# EAGLE design working (EAGLE 6.6.0)
COMPANY: ADAFRUIT INDUSTRIES; DRAWN: KTOWN; REV: A
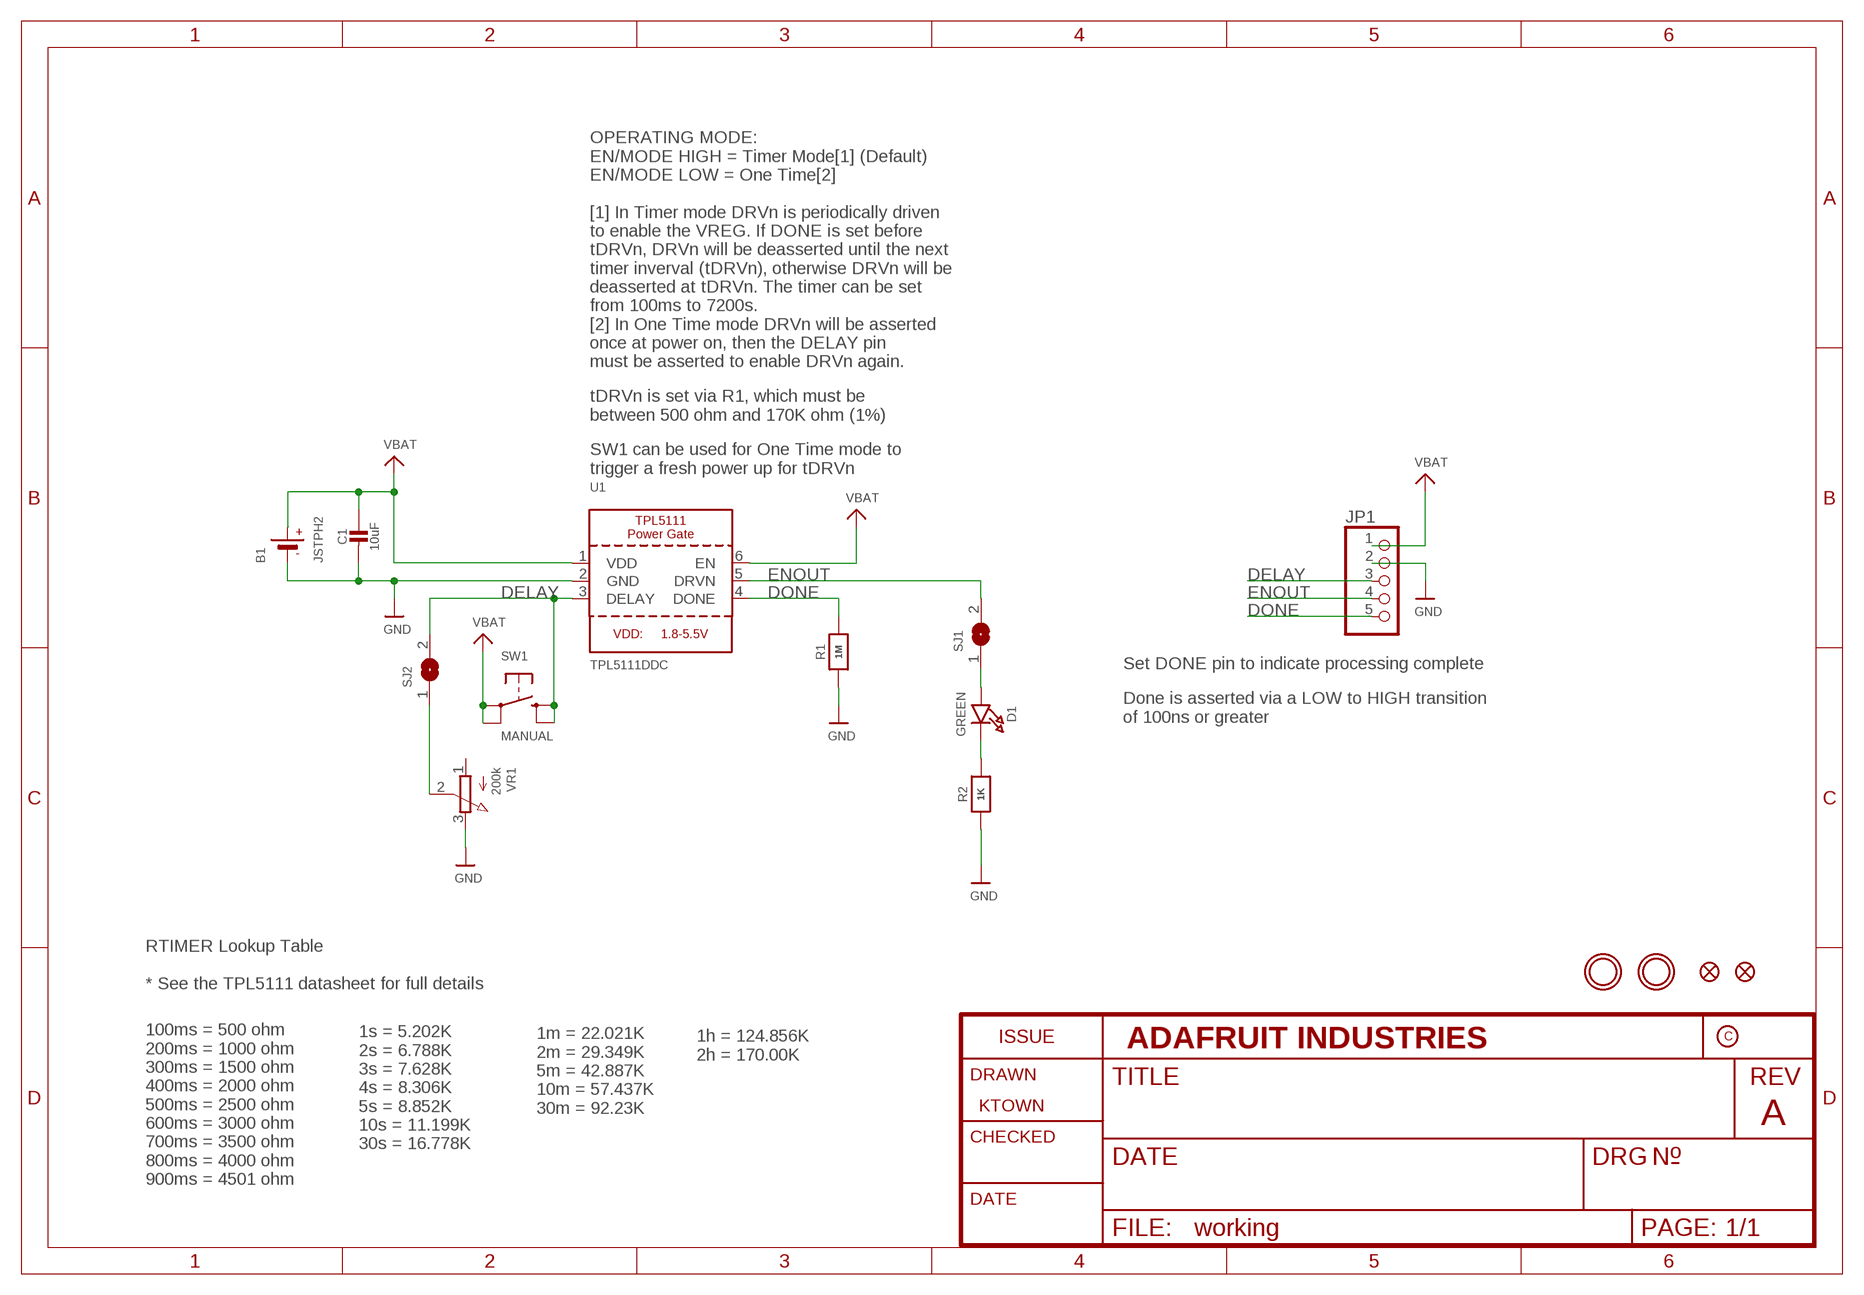
[diagram p0: schematic, sheet 1]

## Parts
B1  JSTPH2  BATTERY  [JSTPH2]
C1  10uF  CAP_CERAMIC0805-NOOUTLINE  [0805-NO]
D1  GREEN  LED0805_NOOUTLINE  [CHIPLED_0805_NOOUTLINE]
FID2  FIDUCIAL_1MM  [FIDUCIAL_1MM]
FID3  FIDUCIAL_1MM  [FIDUCIAL_1MM]
JP1  HEADER-1X576MIL  [1X05_ROUND_76]
R1  1M  RESISTOR0805_NOOUTLINE  [0805-NO]
R2  1K  RESISTOR0805_NOOUTLINE  [0805-NO]
SJ1  SOLDERJUMPERCLOSED  [SOLDERJUMPER_CLOSEDWIRE]
SJ2  SOLDERJUMPERCLOSED  [SOLDERJUMPER_CLOSEDWIRE]
SW1  MANUAL  SWITCH_TACT_SMT_EVQQ2_SMALL  [EVQ-Q2_SMALLER]
U1  TPL5111DDC  TPL5111  [SOT23-6]
U$8  MOUNTINGHOLE2.5  [MOUNTINGHOLE_2.5_PLATED]
U$9  MOUNTINGHOLE2.5  [MOUNTINGHOLE_2.5_PLATED]
VR1  200k  TRIMPOTTC33X-2  [TRIMPOT_BOURNS_TC33X-2]

## Nets
DELAY: JP1.3 SJ2.2 SW1.B'(S1) SW1.B(S) U1.3(DELAY)
DONE: JP1.5 R1.2 U1.4(DONE)
ENOUT: JP1.4 SJ1.2 U1.5(DRVN)
GND: B1.1(-) C1.2 JP1.2 R1.1 R2.1 U1.2(GND) VR1.3(E)
N$1: SJ2.1 VR1.2(S)
N$2: D1.A SJ1.1
N$3: D1.C R2.2
VDD: B1.2(+) C1.1 JP1.1 SW1.A'(P1) SW1.A(P) U1.1(VDD) U1.6(EN) ; supply symbol labelled VBAT
Unconnected: VR1.1(A)

## Notes on the sheet
- OPERATING MODE:
  EN/MODE HIGH = Timer Mode[1] (Default)
  EN/MODE LOW = One Time[2]
  
  [1] In Timer mode DRVn is periodically driven
  to enable the VREG. If DONE is set before
  tDRVn, DRVn will be deasserted until the next
  timer inverval (tDRVn), otherwise DRVn will be
  deasserted at tDRVn. The timer can be set
  from 100ms to 7200s.
  [2] In One Time mode DRVn will be asserted
  once at power on, then the DELAY pin
  must be asserted to enable DRVn again.
- tDRVn is set via R1, which must be
  between 500 ohm and 170K ohm (1%)
- SW1 can be used for One Time mode to
  trigger a fresh power up for tDRVn
- Set DONE pin to indicate processing complete
- Done is asserted via a LOW to HIGH transition
  of 100ns or greater
- RTIMER Lookup Table
  
  * See the TPL5111 datasheet for full details
- 1h = 124.856K
  2h = 170.00K
- 1m = 22.021K
  2m = 29.349K
  5m = 42.887K
  10m = 57.437K
  30m = 92.23K
- 1s = 5.202K
  2s = 6.788K
  3s = 7.628K
  4s = 8.306K
  5s = 8.852K
  10s = 11.199K
  30s = 16.778K
- 100ms = 500 ohm
  200ms = 1000 ohm
  300ms = 1500 ohm
  400ms = 2000 ohm
  500ms = 2500 ohm
  600ms = 3000 ohm
  700ms = 3500 ohm
  800ms = 4000 ohm
  900ms = 4501 ohm

## Library data of the parts
B1 = microbuilder:BATTERY: CR1220 SMT - Digikey: 3001K-ND CD2032 BAT-HLD-001 - Digikey: BAT-HLD-001-ND
C1 = microbuilder:CAP_CERAMIC: Ceramic Capacitors For new designs, use the packages preceded by an '_' character since they are more reliable: The following footprints should be used on most boards: _0402 - Standard footprint for regular board layouts _0603 - Standard footprint for regular board layouts _0805 - Standard footprint for regular board layouts _1206 - Standard footprint for regular board layouts For extremely tight-pitch boards where space is at a premium, the following 'micro-pitch' footprints can be used (smaller pads, no silkscreen outline, etc.): _0402MP - Micro-pitch footprint for very dense/compact boards _0603MP - Micro-pitch footprint for very dense/compact boards _0805MP - Micro-pitch footprint for very dense/compact boards _1206MP - Micro-pitch footprint for very dense/compact boards
D1 = microbuilder:LED: LED 0603 - 0603 Surface Mount Package 2mA: Green LED - Low Power (3.9mcd, 2ma, 1.7Vf) - Digikey: 475-2709-2-ND Orange LED - Low Power (9.8mcd, 2ma, 1.8Vf) - Digikey: 475-1194-2-ND Red LED - Low Power (5mcd, 2ma, 1.8Vf) - Digikey: 475-1195-2-ND Yellow LED - Low Power (7mcd, 2ma, 1.8Vf) - Digikey: 475-1196-2-ND 5mA: Blue LED - Low Power (17mcd, 5ma, 2.9Vf) - Digikey: LNJ937W8CRACT-ND 0805 - 0805 Surface Mount Package 2mA: Red LED (8.8mcd, 2mA, 1.8Vf, Clear) - Low Power [Digikey: 475-2510-1-ND] Green LED (5mcd, 2mA, 1.8Vf, Clear) - Low Power [Digikey: 475-2730-1-ND] Yellow LED (11.3mcd, 2mA, 1.8Vf, Clear) - Low Power [Digikey: 475-2555-1-ND] 20mA: Red LED (104mcd, 20mA, Diffused) - LS R976 [Digikey: 475-1278-6-ND] Red LED (12mcd, 20mA, 2.0Vf, Clear) - APT2012EC [Digikey: 754-1128-1-ND] Green LED (15mcd, 20mA, 2.2Vf, Clear) - APT2012GC [Digikey: 754-1131-1-ND] Orange LED (160mcd, 20mA, 2.1Vf, Clear) - APT2012SECK [Digikey: 754-1130-1-ND] 1206 - 1206 Surface Mount Package Green LED (26mcd, 20mA, Diffused) - LG N971 [Digikey: 475-1407-6-ND] Red LED (15mcd, 20mA, Diffused) - LH N974 [Digikey: 475-1416-6-ND] Cree - Cree High-Power Surface Mount LEDs XPEBWT-L1-0000-00D50 - White 111lm 350mA 2.9Vf 6200K 110° XTEAWT-00-0000-00000LEE3 - White 114lm 350mA 2.85Vf 5000K 115° Everlight - Everlight 45-21 Series Surface Mount LEDs 45-21/QK2C-B2832AC2CB2/2T - Warm White 2000mcd 20mA 3.25Vf 3050K 120° 45-21/LK2C-B38452C4CB2/2T - Nuetral White 2000mcd 20mA 3.25Vf 4150K 120° 45-21/LK2C-B50634C6CB2/2T - Cold White 2200mcd 20mA 3.25Vf 5650K 120° PLCC2 Reverse Mount LS T77K-J1L2-1-0-2-R18-Z - Red 11.25mcd 2mA 1.8Vf 630nm 120° LO T77K-L1M2-24-Z - Orange 19.6mcd 2mA 1.8Vf 606nm 120° LY T77K-K2M1-26-Z - Yellow 15.7mcd 2mA 1.8Vf 587nm 120°
FID2 FID3 = microbuilder:FIDUCIAL: Fiducial Alignment Points Various fiducial points for machine vision alignment.; BOM: EXCLUDE
JP1 = microbuilder:HEADER-1X5: PIN HEADER
R1 R2 = microbuilder:RESISTOR: Resistors For new designs, use the packages preceded by an '_' character since they are more reliable: The following footprints should be used on most boards: _0402 - Standard footprint for regular board layouts _0603 - Standard footprint for regular board layouts _0805 - Standard footprint for regular board layouts _1206 - Standard footprint for regular board layouts For extremely tight-pitch boards where space is at a premium, the following 'micro-pitch' footprints can be used (smaller pads, no silkscreen outline, etc.): _0402MP - Micro-pitch footprint for very dense/compact boards _0603MP - Micro-pitch footprint for very dense/compact boards _0805MP - Micro-pitch footprint for very dense/compact boards _1206MP - Micro-pitch footprint for very dense/compact boards
SJ1 SJ2 = microbuilder:SOLDERJUMPER: SMD Solder JUMPER Solder the two pads together to create a connection, or remove the solder to break it. REFLOW - Use this footprint for solder paste and reflow ovens. WAVE - Use this footprint for hand-soldering (larger pads). CLOSED - Has a trace between the two pads to ensure it is closed by default. The trace needs to be cut to disable the jumper, and can be closed again by creating a solder bridge between the two pads.
SW1 = microbuilder:SWITCH_TACT_SMT: SMT Tact Switches 6x6mm - Digikey: P12940SCT-ND KMR2 (4.6x2.8mm) - Digikey: 401-1426-1-ND EVQ-PQHB55 - Light Touch, 160GF (4.5x4.5mm) - Digikey: P8090SCT-ND KMT0 - KMT021 NGJ LHS (etc.) IP68/Waterproof - Digikey: CKN10289CT-ND
U1 = microbuilder:TPL5111: TPL5111 Timer Based Power Gate Selectable Time Intervals: 100 ms to 7200 s Current Consumption at 2.5 V: 35 nA (typical) Supply Voltage Range: 1.8 V to 5.5 V
U$8 U$9 = microbuilder:MOUNTINGHOLE: Mounting Hole For #2 screws (0.086"/2.18mm width, 0.094"/2.4mm hole) use 2.5mm; BOM: EXCLUDE
VR1 = microbuilder:TRIMPOT: 3-Pin SMT Trimpots Bourns TC33 (X-2) Series 1K - Digikey: TC33X-102ECT-ND 10K - Digikey: TC33X-2-103E 100K - Digikey: TC33X-104ECT-ND Bourns 3303 (W) Series 3mm 10K Single Turn - Digikey: 3303W-103ETR-ND 3mm 100K Single Turn - Digikey: 3303X-104ETR-ND

## Board
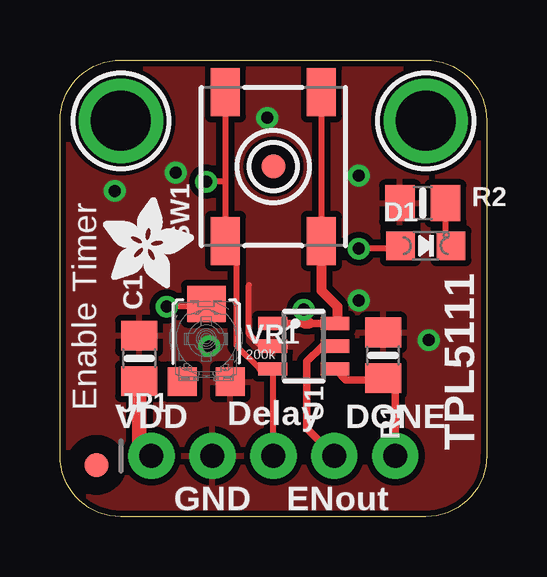
[diagram p1: board, top side]
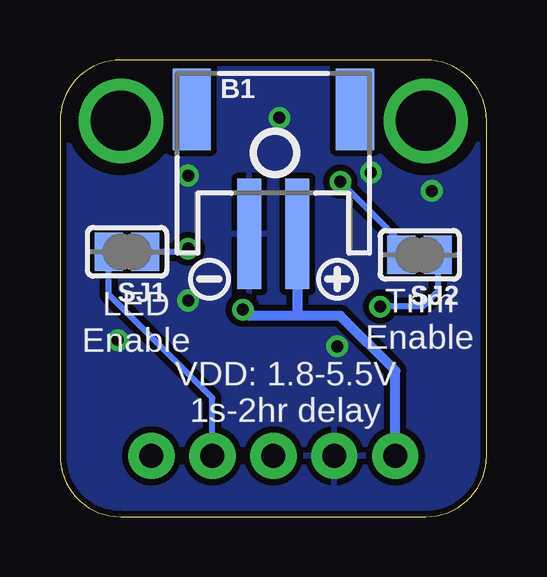
[diagram p2: board, bottom side, seen from below]

Size 17.78 x 19.05 mm. Coordinates in mm from the lower left corner, seen from the top.
Outline: 0,2.54 0,16.51 arc-90 2.54,19.05 15.24,19.05 arc-90 17.78,16.51 17.78,2.54 arc-90 15.24,0 2.54,0 arc-90 0,2.54
Copper layers (1*16): Top 0.035mm / dielectric 1.5mm / Bottom 0.035mm
Design rules "adafruit *": minimum track width 8mil, minimum drill 15.5mil, track to track 8mil, track to pad 8mil, pad to pad 8mil, via to via 8mil, smd to smd 8mil, copper to edge 10mil, drill to drill 8mil, minimum pad ring 10mil, minimum via ring 8mil, stop-mask expansion 2mil, vias tented up to drill 20mil, thermal gap 10mil

### Footprints (pad centres in the part's own frame; a part is rotated, then mirrored left to right if it is on the bottom)
JSTPH2 = smd 1 x 4.6: 1 -1,-3.7; 2 1,-3.7 | smd 1.6 x 3.4: NC1 -3.4,1.5; NC2 3.4,1.5
0805-NO = smd 1.24 x 1.5: 1 -0.95,0; 2 0.95,0
CHIPLED_0805_NOOUTLINE = smd 1.2 x 1.2: A 0,-1.05; C 0,1.05
FIDUCIAL_1MM = smd 1 x 1: 1 0,0
1X05_ROUND_76 = drill 1 pad 1.93: 1 -5.08,0; 2 -2.54,0; 3 0,0; 4 2.54,0; 5 5.08,0
SOLDERJUMPER_CLOSEDWIRE = smd 1.168 x 1.6: 1 -0.762,0; 2 0.762,0 | smd 0.635 x 0.203: WIRE 0,0
EVQ-Q2_SMALLER = smd 2 x 1.2: A -3.1,-2; A' 3.1,-2; B -3.1,2; B' 3.1,2
SOT23-6 = smd 0.55 x 1.2: 1 -0.95,-1.3; 2 0,-1.3; 3 0.95,-1.3; 4 0.95,1.3; 5 0,1.3; 6 -0.95,1.3
MOUNTINGHOLE_2.5_PLATED = drill 2.5 pad 3.2: P$1 0,0
TRIMPOT_BOURNS_TC33X-2 = smd 1.2 x 1.2: 1 -1,-1.8; 3 1,-1.8 | smd 1.6 x 1.5: 2 0,1.45

### Placement (x,y rotation side)
B1  8.89,15.49 0 bottom
C1  3.3,6.6 90 top
D1  15.24,11.3 270 top
FID2  8.89,14.61 0 top
FID3  1.52,2.16 0 top
JP1  8.89,2.54 0 top
R1  13.46,6.73 270 top
R2  15.11,13.08 0 top
SJ1  14.99,11.05 180 bottom
SJ2  2.79,10.92 180 bottom
SW1  8.89,14.61 90 top
U1  10.16,7.11 270 top
U$8  15.24,16.51 0 top
U$9  2.54,16.51 0 top
U$10  [ADAFRUIT_3.5MM]  1.78,9.53 0 top
U$11  [SYMBOL_PLUS]  6.22,9.91 0 bottom
U$12  [SYMBOL_MINUS]  11.56,9.91 0 bottom
U$15  [PCBFEAT-REV-040]  8.83,15.18 0 bottom
VR1  6.1,7.43 0 top

### Tracks (layer width: path | path; a pad name or v marks a point on that pad's centre or on a via)
DELAY  (via drill 0.5)
  Top 0.254: SW1.B' 6.89,13.91 | 6.89,13.91 SW1.B 6.95,11.51 7.37,11.09 7.37,7.11 8.32,6.16 U1.3 | 6.89,13.91 6.83,13.97 v6.1,13.97 | JP1.3 8.89,6.13 U1.3 | U1.3 8.39,6.16 8.38,6.16
  Bottom 0.254: v6.1,13.97 3.56,11.43 SJ2.2
DONE
  Top 0.254: 13.97,3.37 JP1.5
  Top 0.305: R1.2 13.97,5.78 13.97,5.71 | 13.97,5.71 13.97,3.37 | U1.4 11.91,5.71 13.97,5.71
  Bottom 0.254: 13.97,2.79 JP1.5
ENOUT
  Top 0.254: U1.5 10.92,7.11
  Top 0.305: 10.92,7.11 10.29,6.48 10.29,3.68 JP1.4
  Bottom 0.254: JP1.4 11.43,4.95 15.75,9.27 SJ1.2
GND  (via drill 0.5)
  Top 0.254: 7.87,9.65 7.87,7.62 8.38,7.11 U1.2
  other vias: 12.45,9.02 12.45,14.22 15.37,7.37 2.29,13.59 8.64,16.64 4.83,14.35 6.22,7.11
  pour Bottom (isolate 0.254): 0,2.54 0,16.51 arc-90 2.54,19.05 15.24,19.05 arc-90 17.78,16.51 17.78,2.54 arc-90 15.24,0 2.54,0 arc-90
  pour Top (isolate 0.254): 0,2.54 0,16.51 arc-90 2.54,19.05 15.24,19.05 arc-90 17.78,16.51 17.78,2.54 arc-90 15.24,0 2.54,0 arc-90
N$1  (via drill 0.5)
  Top 0.254: VR1.2 5.98,8.76 v4.45,8.76
  Bottom 0.254: SJ2.1 2.03,9.4 2.67,8.76 v4.45,8.76
N$2  (via drill 0.5)
  Top 0.254: D1.A 14.06,11.18 v12.45,11.18
  Bottom 0.254: v12.45,11.18 12.57,11.05 SJ1.1
N$3
  Top 0.254: D1.C 16.06,11.53 R2.2
VDD  (via drill 0.5)
  Top 0.254: SW1.A' SW1.A
  Top 0.305: U1.1 10.16,8.06 | 10.41,8.06 U1.6
  Top 0.406: v10.16,8.64 10.16,8.06 10.41,8.06 | SW1.A 10.89,9.43 11.56,8.76 11.56,8.16 U1.6
  Top 0.61: C1.1 3.3,2.67 3.43,2.54 JP1.1
  Bottom 0.406: JP1.1 3.81,6.1 6.1,8.38 7.87,8.38 | B1.2 7.89,8.4 7.87,8.38 | 7.87,8.38 9.91,8.38 v10.16,8.64

### Text on the board
tPlace: Enable Timer | TPL5111 | VDD | Delay | DONE | GND | ENout
bPlace: Trim / Enable | LED / Enable | VDD: 1.8-5.5V / 1s-2hr delay